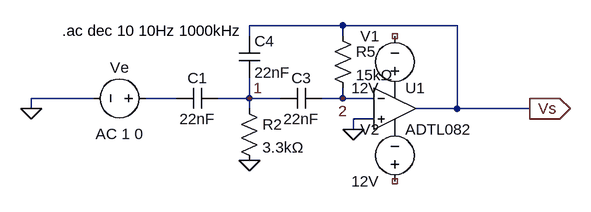
[diagram p0: schematic passe-haut.asc]
passe-haut.asc, the LTspice schematic file:
Version 4
SHEET 1 880 680
WIRE 128 48 -16 48
WIRE 304 48 128 48
WIRE -16 64 -16 48
WIRE 128 64 128 48
WIRE -256 160 -352 160
WIRE -128 160 -176 160
WIRE -16 160 -16 128
WIRE -16 160 -64 160
WIRE 32 160 -16 160
WIRE 128 160 128 144
WIRE 128 160 96 160
WIRE 176 160 128 160
WIRE -352 176 -352 160
WIRE -16 176 -16 160
WIRE 304 176 304 48
WIRE 304 176 240 176
WIRE 416 176 304 176
WIRE 176 192 144 192
WIRE 144 208 144 192
FLAG 144 208 0
FLAG -16 160 1
FLAG 128 160 2
FLAG -352 176 0
FLAG -16 256 0
FLAG 416 176 Vs
IOPIN 416 176 Out
SYMBOL OpAmps\\ADTL082 208 112 R0
SYMATTR InstName U1
SYMBOL voltage -160 160 R90
WINDOW 0 -32 56 VBottom 2
WINDOW 3 32 56 VTop 2
WINDOW 123 39 56 VTop 2
WINDOW 39 0 0 Left 0
SYMATTR InstName Ve
SYMATTR Value ""
SYMATTR Value2 AC 1 0
SYMBOL cap -32 64 R0
SYMATTR InstName C4
SYMATTR Value 22nF
SYMBOL cap -64 144 R90
WINDOW 0 0 32 VBottom 2
WINDOW 3 32 32 VTop 2
SYMATTR InstName C1
SYMATTR Value 22nF
SYMBOL cap 96 144 R90
WINDOW 0 0 32 VBottom 2
WINDOW 3 32 32 VTop 2
SYMATTR InstName C3
SYMATTR Value 22nF
SYMBOL res 112 48 R0
SYMATTR InstName R5
SYMATTR Value 15kΩ
SYMBOL res -32 160 R0
SYMATTR InstName R2
SYMATTR Value 3.3kΩ
SYMBOL voltage 208 160 R180
WINDOW 0 24 96 Left 2
WINDOW 3 24 16 Left 2
WINDOW 123 0 0 Left 0
WINDOW 39 0 0 Left 0
SYMATTR InstName V1
SYMATTR Value 12V
SYMBOL voltage 208 304 R180
WINDOW 0 24 96 Left 2
WINDOW 3 24 16 Left 2
WINDOW 123 0 0 Left 0
WINDOW 39 0 0 Left 0
SYMATTR InstName V2
SYMATTR Value 12V
TEXT -304 56 Left 2 !.ac dec 10 10Hz 1000kHz

The netlist it stands for:
* passe-haut.asc
XU1 0 2 P001 P002 Vs ADTL082  ; pins In+ In- V+ V- OUT
Ve N001 0 AC 1 0
C4 Vs 1 22nF
C1 1 N001 22nF
C3 2 1 22nF
R5 Vs 2 15kΩ
R2 1 0 3.3kΩ
V1 P001 NC_01 12V
V2 NC_02 P002 12V
.ac dec 10 10Hz 1000kHz
.lib ADI.lib
.backanno
.end

* Results of the author's LTspice run, read from the files saved beside the schematic
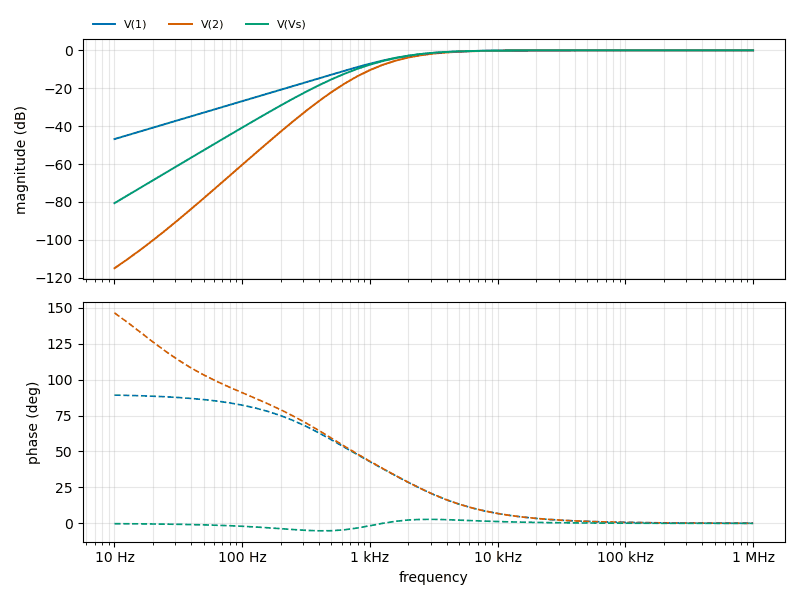
[diagram p1: AC Analysis of passe-haut.asc, plotted from the saved traces]
* AC Analysis, 1 run:
*   V(1): -46.82 dB at 10 Hz, -0.00 dB at 1 MHz, peak -0.00 dB at 1 MHz, 3 dB below the peak at 1.92 kHz
*   V(2): -114.98 dB at 10 Hz, -0.00 dB at 1 MHz, peak -0.00 dB at 1 MHz, 3 dB below the peak at 2.311 kHz
*   V(Vs): -80.62 dB at 10 Hz, -0.00 dB at 1 MHz, peak -0.00 dB at 1 MHz, 3 dB below the peak at 1.947 kHz